# Altium project EtherWiz.PrjPcb
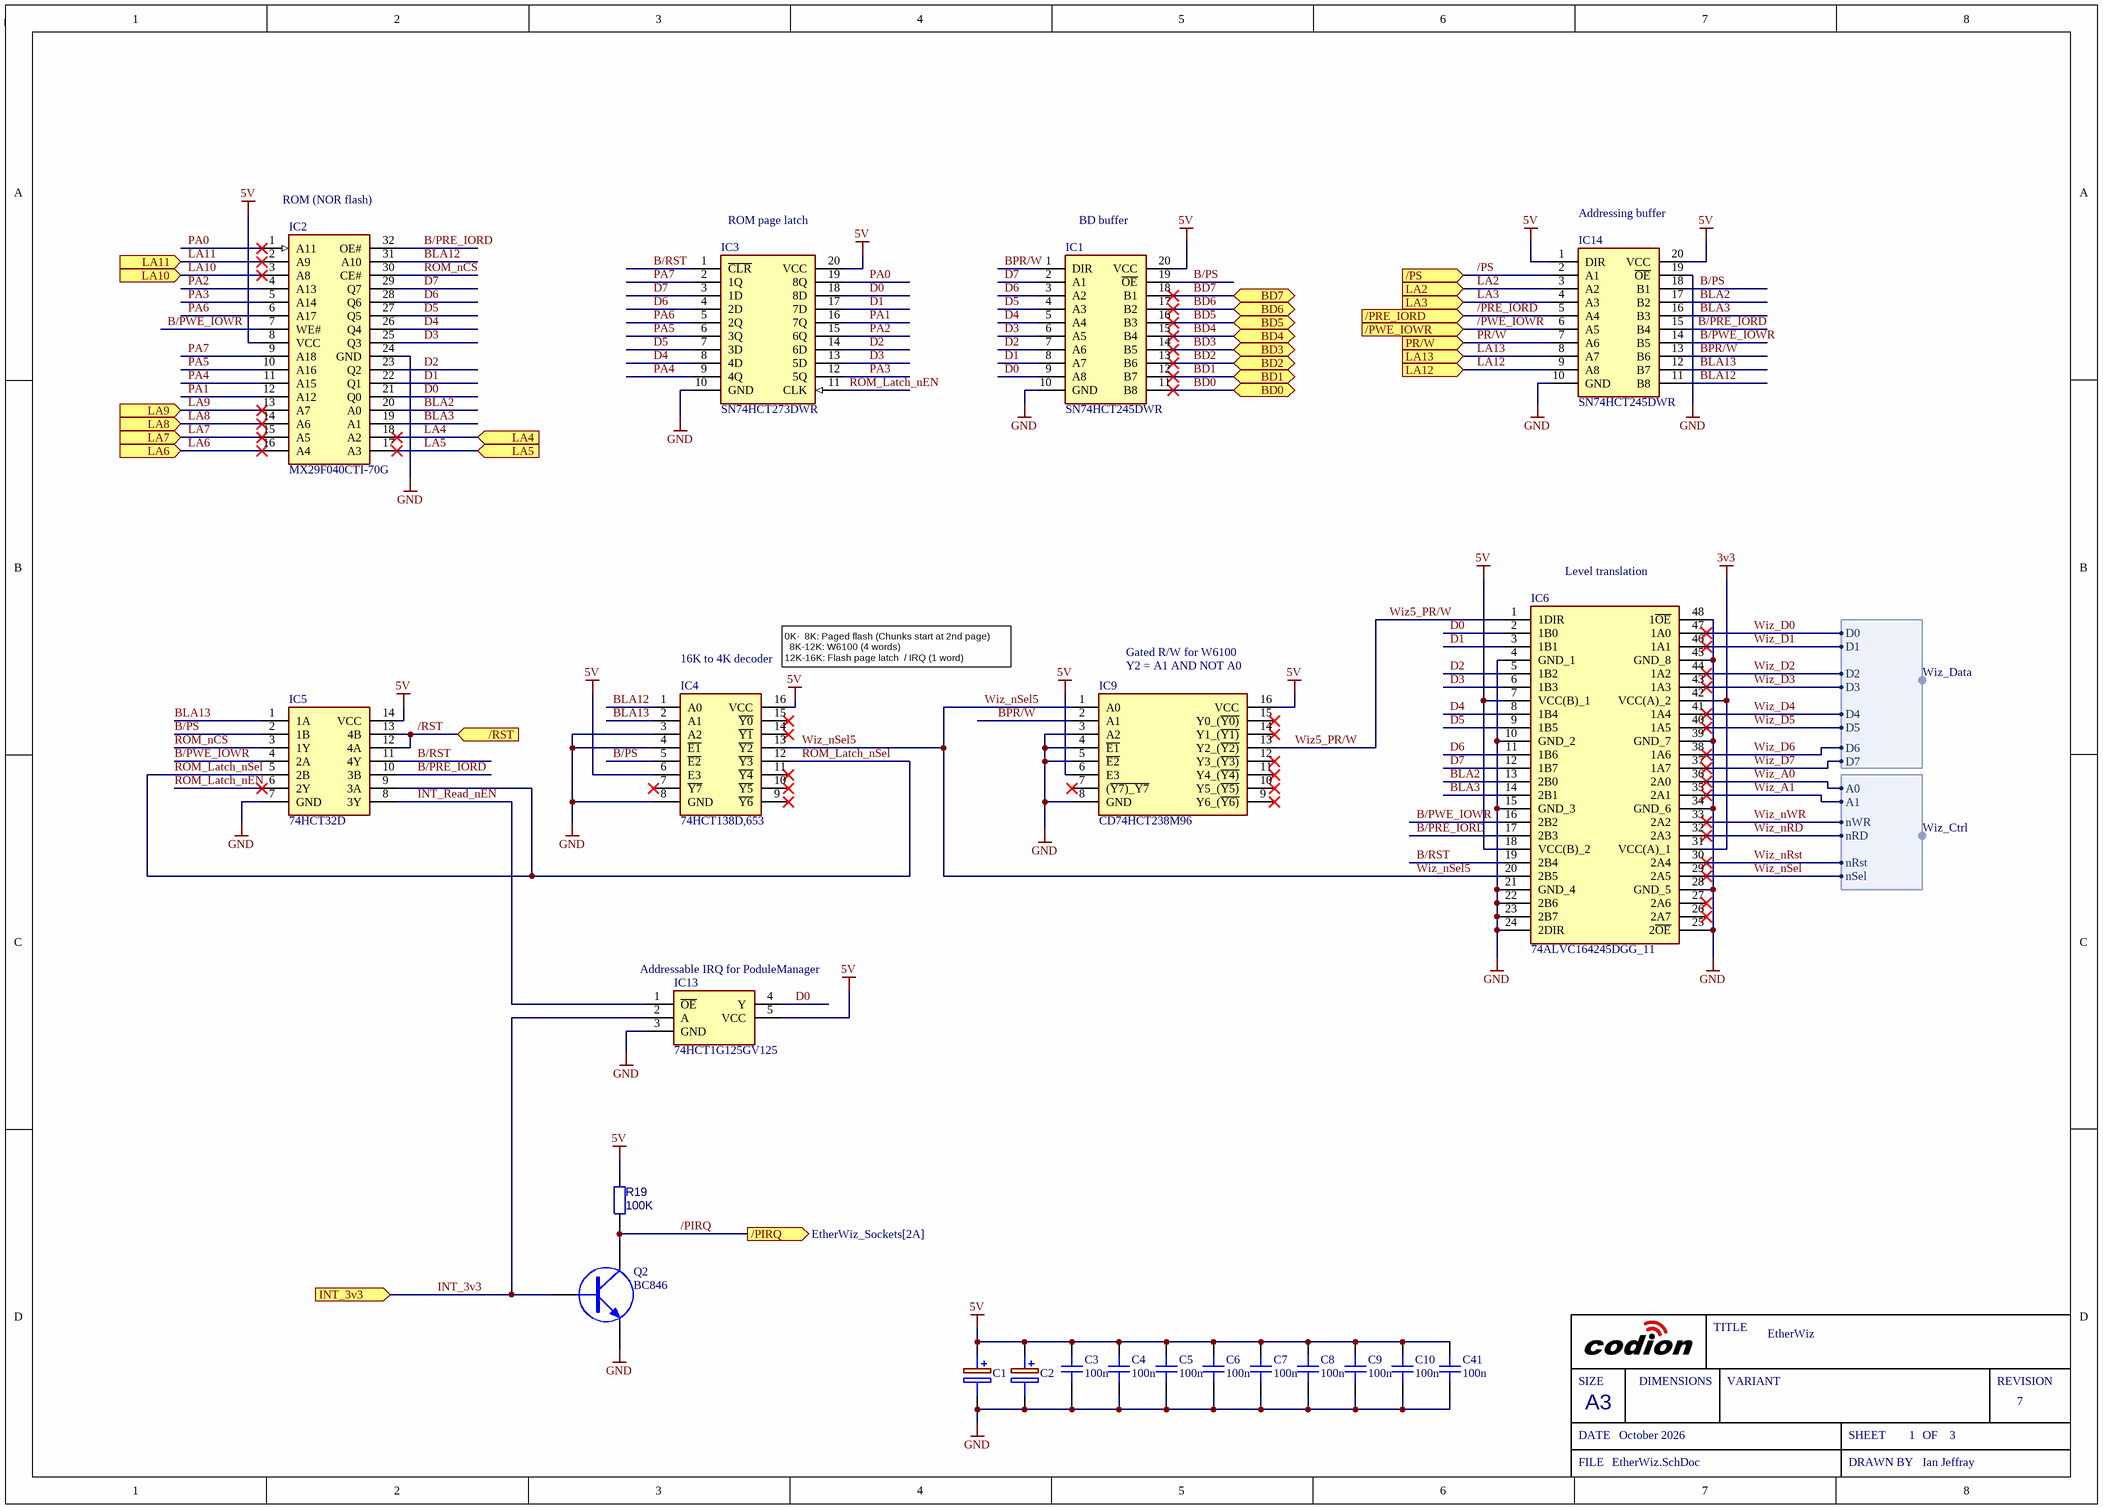
[diagram p0: EtherWiz.SchDoc]
Sch_RevNo: 7; Sch_ReleaseDate: October 2026; Project_Title: EtherWiz; PCB_RevNo: 1.1; DrawnBy: Ian Jeffray
3 sheets, 83 parts. Net scope: global (net labels, ports and power ports of the same name join across sheets).
Board files: EtherWiz.PcbDoc, EtherWizMini.PcbDoc, EtherWizA4.PcbDoc, EtherWiz3K4KNic.PcbDoc, EtherWizRiscPC7K.PcbDoc
Sheets:
  EtherWiz.SchDoc
  EtherWiz_Controller.SchDoc
  EtherWiz_Sockets.SchDoc

## Sheet EtherWiz.SchDoc
size A3; SheetNumber: 1; SheetTotal: 3

### Parts
C1  EEE-HA1C470AP  [EEE1AA101SP]  (value not drawn)
C2  EEE-HA1C470AP  [EEE1AA101SP]  (value not drawn)
C3  100n  [CAPC1608L]
C4  100n  [CAPC1608L]
C5  100n  [CAPC1608L]
C6  100n  [CAPC1608L]
C7  100n  [CAPC1608L]
C8  100n  [CAPC1608L]
C9  100n  [CAPC1608L]
C10  100n  [CAPC1608L]
C41  100n  [CAPC1608L]
IC1  SN74HCT245DWR  [SOIC127P1030X265-20N]
IC2  MX29F040CTI-70G  [SOP50P2000X120-32N]
IC3  SN74HCT273DWR  [SOIC127P1030X265-20N]
IC4  74HCT138D,653  [SOIC127P600X175-16N]
IC5  74HCT32D  [SOIC127P600X175-14N]
IC6  74ALVC164245DGG_11  [SOP50P810X120-48N]
IC9  CD74HCT238M96  [SOIC127P600X175-16N]
IC13  74HCT1G125GV125  [SOT95P275X110-5N]
IC14  SN74HCT245DWR  [SOIC127P1030X265-20N]
Q2  BC846  [SOT-23]
R19  100K  [RESC1608X50N]

### Ports
/PIRQ (out, see EtherWiz_Sockets[2A]), /PRE_IORD (in, see EtherWiz_Sockets[2A]), /PS (in, see EtherWiz_Sockets[2B]), /PWE_IOWR (in, see EtherWiz_Sockets[2A]), /RST (in, see EtherWiz_Sockets[2A]), BD0 (bidir, see EtherWiz_Sockets[1B]), BD1 (bidir, see EtherWiz_Sockets[1B]), BD2 (bidir, see EtherWiz_Sockets[1B]), BD3 (bidir, see EtherWiz_Sockets[1B]), BD4 (bidir, see EtherWiz_Sockets[1B]), BD5 (bidir, see EtherWiz_Sockets[1B]), BD6 (bidir, see EtherWiz_Sockets[1B]), BD7 (bidir, see EtherWiz_Sockets[1B]), INT_3v3 (in, see EtherWiz_Controller[5A]), LA2 (in, see EtherWiz_Sockets[1A]), LA3 (in, see EtherWiz_Sockets[1A]), LA4 (in, see EtherWiz_Sockets[1A]), LA5 (in, see EtherWiz_Sockets[1A]), LA6 (in, see EtherWiz_Sockets[1A]), LA7 (in, see EtherWiz_Sockets[1A]), LA8 (in, see EtherWiz_Sockets[1A]), LA9 (in, see EtherWiz_Sockets[1A]), LA10 (in, see EtherWiz_Sockets[1A]), LA11 (in, see EtherWiz_Sockets[1A]), LA12 (in, see EtherWiz_Sockets[1A]), LA13 (in, see EtherWiz_Sockets[1A]), PR/W (in, see EtherWiz_Sockets[2A])

### Harnesses
Wiz_Data: D3, D7, D6, D0, D1, D5, D4, D2
Wiz_Ctrl: A0, A1, nWR, nRD, nRst, nSel

### Nets
3v3: IC6.31(VCC(A)_1) IC6.42(VCC(A)_2)
5V: C1.1(+) C2.1(+) C3.2 C4.2 C5.2 C6.2 C7.2 C8.2 C9.2 C10.2 C41.2 IC1.20(VCC) IC2.8(VCC) IC3.20(VCC) IC4.6(E3) IC4.16(VCC) IC5.14(VCC) IC6.7(VCC(B)_1) IC6.18(VCC(B)_2) IC9.6(E3) IC9.16(VCC) IC13.5(VCC) IC14.1(DIR) IC14.20(VCC) R19.2
GND: C1.2(-) C2.2(-) C3.1 C4.1 C5.1 C6.1 C7.1 C8.1 C9.1 C10.1 C41.1 IC1.10(GND) IC2.24(GND) IC3.10(GND) IC4.3(A2) IC4.4(~{E1}) IC4.8(GND) IC5.7(GND) IC6.4(GND_1) IC6.10(GND_2) IC6.15(GND_3) IC6.21(GND_4) IC6.22(2B6) IC6.23(2B7) IC6.24(2DIR) IC6.25(2~{OE}) IC6.28(GND_5) IC6.34(GND_6) IC6.39(GND_7) IC6.45(GND_8) IC6.48(1~{OE}) IC9.3(A2) IC9.4(~{E1}) IC9.5(~{E2}) IC9.8(GND) IC13.3(GND) IC14.10(GND) IC14.19(~{OE}) Q2.2(E)
/PIRQ: Q2.3(C) R19.1 ; port /PIRQ
/PRE_IORD: IC14.5(A4) ; port /PRE_IORD
/PS: IC14.2(A1) ; port /PS
/PWE_IOWR: IC14.6(A5) ; port /PWE_IOWR
/RST: IC5.12(4A) IC5.13(4B) ; port /RST
B/PRE_IORD: IC2.32(OE#) IC5.10(3B) IC6.17(2B3) IC14.15(B4)
B/PS: IC1.19(~{OE}) IC4.5(~{E2}) IC5.2(1B) IC14.18(B1)
B/PWE_IOWR: IC2.7(WE#) IC5.4(2A) IC6.16(2B2) IC14.14(B5)
B/RST: IC3.1(~{CLR}) IC5.11(4Y) IC6.19(2B4)
BD0: IC1.11(B8) ; port BD0
BD1: IC1.12(B7) ; port BD1
BD2: IC1.13(B6) ; port BD2
BD3: IC1.14(B5) ; port BD3
BD4: IC1.15(B4) ; port BD4
BD5: IC1.16(B3) ; port BD5
BD6: IC1.17(B2) ; port BD6
BD7: IC1.18(B1) ; port BD7
BLA2: IC2.20(A0) IC6.13(2B0) IC14.17(B2)
BLA3: IC2.19(A1) IC6.14(2B1) IC14.16(B3)
BLA12: IC2.31(A10) IC4.1(A0) IC14.11(B8)
BLA13: IC4.2(A1) IC5.1(1A) IC14.12(B7)
BPR/W: IC1.1(DIR) IC9.2(A1) IC14.13(B6)
D0: IC1.9(A8) IC2.21(Q0) IC3.18(8D) IC6.2(1B0) IC13.4(Y)
D1: IC1.8(A7) IC2.22(Q1) IC3.17(7D) IC6.3(1B1)
D2: IC1.7(A6) IC2.23(Q2) IC3.14(6D) IC6.5(1B2)
D3: IC1.6(A5) IC2.25(Q3) IC3.13(5D) IC6.6(1B3)
D4: IC1.5(A4) IC2.26(Q4) IC3.8(4D) IC6.8(1B4)
D5: IC1.4(A3) IC2.27(Q5) IC3.7(3D) IC6.9(1B5)
D6: IC1.3(A2) IC2.28(Q6) IC3.4(2D) IC6.11(1B6)
D7: IC1.2(A1) IC2.29(Q7) IC3.3(1D) IC6.12(1B7)
INT_3v3: IC13.2(A) Q2.1(B) ; port INT_3v3
INT_Read_nEN: IC5.8(3Y) IC13.1(~{OE})
LA2: IC14.3(A2) ; port LA2
LA3: IC14.4(A3) ; port LA3
LA4: IC2.18(A2) ; port LA4
LA5: IC2.17(A3) ; port LA5
LA6: IC2.16(A4) ; port LA6
LA7: IC2.15(A5) ; port LA7
LA8: IC2.14(A6) ; port LA8
LA9: IC2.13(A7) ; port LA9
LA10: IC2.3(A8) ; port LA10
LA11: IC2.2(A9) ; port LA11
LA12: IC14.9(A8) ; port LA12
LA13: IC14.8(A7) ; port LA13
PA0: IC2.1(A11) IC3.19(8Q)
PA1: IC2.12(A12) IC3.16(7Q)
PA2: IC2.4(A13) IC3.15(6Q)
PA3: IC2.5(A14) IC3.12(5Q)
PA4: IC2.11(A15) IC3.9(4Q)
PA5: IC2.10(A16) IC3.6(3Q)
PA6: IC2.6(A17) IC3.5(2Q)
PA7: IC2.9(A18) IC3.2(1Q)
PR/W: IC14.7(A6) ; port PR/W
ROM_Latch_nEN: IC3.11(CLK) IC5.6(2Y)
ROM_Latch_nSel: IC4.12(~{Y3}) IC5.5(2B) IC5.9(3A)
ROM_nCS: IC2.30(CE#) IC5.3(1Y)
Wiz5_PR/W: IC6.1(1DIR) IC9.13(Y2_(~{Y2)})
Wiz_A0: IC6.36(2A0) ; harness Wiz_Ctrl.A0
Wiz_A1: IC6.35(2A1) ; harness Wiz_Ctrl.A1
Wiz_D0: IC6.47(1A0) ; harness Wiz_Data.D0
Wiz_D1: IC6.46(1A1) ; harness Wiz_Data.D1
Wiz_D2: IC6.44(1A2) ; harness Wiz_Data.D2
Wiz_D3: IC6.43(1A3) ; harness Wiz_Data.D3
Wiz_D4: IC6.41(1A4) ; harness Wiz_Data.D4
Wiz_D5: IC6.40(1A5) ; harness Wiz_Data.D5
Wiz_D6: IC6.38(1A6) ; harness Wiz_Data.D6
Wiz_D7: IC6.37(1A7) ; harness Wiz_Data.D7
Wiz_nRD: IC6.32(2A3) ; harness Wiz_Ctrl.nRD
Wiz_nRst: IC6.30(2A4) ; harness Wiz_Ctrl.nRst
Wiz_nSel: IC6.29(2A5) ; harness Wiz_Ctrl.nSel
Wiz_nSel5: IC4.13(~{Y2}) IC6.20(2B5) IC9.1(A0)
Wiz_nWR: IC6.33(2A2) ; harness Wiz_Ctrl.nWR

Not connected (* = marked no-connect by the designer): IC4 7(~{Y7})* 9(~{Y6})* 10(~{Y5})* 11(~{Y4})* 14(~{Y1})* 15(~{Y0})*; IC6 26(2A7)* 27(2A6)*; IC9 7((~{Y7)_Y7})* 9(Y6_(~{Y6)})* 10(Y5_(~{Y5)})* 11(Y4_(~{Y4)})* 12(Y3_(~{Y3)})* 14(Y1_(~{Y1)})* 15(Y0_(~{Y0)})*

### Notes on the sheet
- (near IC2) ROM (NOR flash)
- (near IC3) ROM page latch
- (near IC1) BD buffer
- (near IC14) Addressing buffer
- (near IC6) Level translation
- (near IC4) 16K to 4K decoder
- (near IC4) 0K-  8K: Paged flash (Chunks start at 2nd page)
  8K-12K: W6100 (4 words)
  12K-16K: Flash page latch  / IRQ (1 word)
- (near IC9) Gated R/W for W6100
- (near IC9) Y2 = A1 AND NOT A0
- (near IC13) Addressable IRQ for PoduleManager
- SIZE
- DIMENSIONS
- TITLE
- VARIANT
- REVISION
- DATE
- A3
- SHEET
- OF
- FILE
- DRAWN BY

### Library data of the parts
C1 C2 = EEE-HA1C470AP: Capacitor Polarised; Manufacturer_Name: Panasonic; Datasheet Link: http://industrial.panasonic.com/cdbs/www-data/pdf/RDE0000/ABA0000C1148.pdf; Height: 7.8mm; Manufacturer_Part_Number: EEE-HA1C470AP; Mouser Part Number: 667-EEE-HA1C470AP; Mouser Price/Stock: https://www.mouser.co.uk/ProductDetail/Panasonic/EEE-HA1C470AP?qs=d1CqaRUMZD%2FL5qU1hDRerg%3D%3D; Arrow Part Number: EEE-HA1C470AP; Arrow Price/Stock: https://www.arrow.com/en/products/eeeha1c470ap/panasonic?utm_currency=USD&region=europe
C3-C10 C41 = CAP_100n_0603_50V_0: CAP 100nF, 0603, 50V, X7R, 10%; Manufacturer1: Samsung; ManuPart1: CL10B104KB8NNNC; ManuPart2: CC0603KRX7R9BB104; Value: 100n; Distributor1: Anglia; Manufacturer2: Yageo; Distributor2: Digikey; Distributor1 Part No: CL10B104KB8NNNC; Distributor2 Part No: 311-1344-2-ND; ComponentLinknURL: *; ComponentLink1Description: ComponentLinknURL1; ComponentLink1URL: https://media.digikey.com/pdf/Data%20Sheets/Samsung%20PDFs/CL_Series_MLCC_ds.pdf; ComponentLink2Description: ComponentLinknURL2; ComponentLink2URL: https://www.yageo.com/upload/media/product/productsearch/datasheet/mlcc/UPY-GPHC_X7R_6.3V-to-50V_18.pdf; Voltage: 50V
IC1 IC14 = SN74HCT245DWR: Integrated Circuit; Manufacturer_Name: Texas Instruments; Datasheet Link: https://datasheet.datasheetarchive.com/originals/distributors/SFDatasheet-6/sf-000131457.pdf; Height: 2.65mm; Manufacturer_Part_Number: SN74HCT245DWR; Mouser Part Number: 595-SN74HCT245DWR; Mouser Price/Stock: https://www.mouser.co.uk/ProductDetail/Texas-Instruments/SN74HCT245DWR?qs=st7IWvlL5%2FhHLMwvvkYTgw%3D%3D; Arrow Part Number: SN74HCT245DWR; Arrow Price/Stock: https://www.arrow.com/en/products/sn74hct245dwr/texas-instruments?region=nac
IC2 = MX29F040CTI-70G: Integrated Circuit; Manufacturer_Name: Macronix; Datasheet Link: https://www.macronix.com/Lists/Datasheet/Attachments/7266/MX29F040C,%205V,%204Mb,%20v2.2.pdf; Height: 1.2mm; Manufacturer_Part_Number: MX29F040CTI-70G; Arrow Part Number: MX29F040CTI-70G; Arrow Price/Stock: https://www.arrow.com/en/products/mx29f040cti-70g/macronix-international?region=nac
IC3 = SN74HCT273DWR: Integrated Circuit; Manufacturer_Name: Texas Instruments; Datasheet Link: https://datasheet.datasheetarchive.com/originals/distributors/Datasheets-36/DSA-718641.pdf; Height: 2.65mm; Manufacturer_Part_Number: SN74HCT273DWR; Mouser Part Number: 595-SN74HCT273DWR; Mouser Price/Stock: https://www.mouser.co.uk/ProductDetail/Texas-Instruments/SN74HCT273DWR?qs=SL3LIuy2dWww%2FZr6up0MdA%3D%3D; Arrow Part Number: SN74HCT273DWR; Arrow Price/Stock: https://www.arrow.com/en/products/sn74hct273dwr/texas-instruments
IC4 = 74HCT138D,653: Integrated Circuit; Manufacturer_Name: Nexperia; Datasheet Link: https://assets.nexperia.com/documents/data-sheet/74HC_HCT138.pdf; Height: 1.75mm; Manufacturer_Part_Number: 74HCT138D,653; Mouser Part Number: 771-74HCT138D-T; Mouser Price/Stock: https://www.mouser.co.uk/ProductDetail/Nexperia/74HCT138D653?qs=P62ublwmbi8MKahyK7iY6g%3D%3D; Arrow Part Number: 74HCT138D,653; Arrow Price/Stock: https://www.arrow.com/en/products/74hct138d653/nexperia?region=nac
IC5 = 74HCT32D: Integrated Circuit; Manufacturer_Name: Toshiba; Datasheet Link: https://toshiba.semicon-storage.com/info/docget.jsp?did=37176&prodName=74HCT32D; Height: 1.75mm; Manufacturer_Part_Number: 74HCT32D; Mouser Part Number: N/A; Mouser Price/Stock: https://www.mouser.co.uk/ProductDetail/Toshiba/74HCT32D?qs=j%252B1pi9TdxUZqVZos7uP1Yw%3D%3D; Arrow Part Number: 74HCT32D; Arrow Price/Stock: https://www.arrow.com/en/products/74hct32d/toshiba?region=nac
IC6 = 74ALVC164245DGG_11: Integrated Circuit; Manufacturer_Name: Nexperia; Manufacturer_Part_Number: 74ALVC164245DGG:11; Datasheet Link: https://assets.nexperia.com/documents/data-sheet/74ALVC164245.pdf; Height: 1.2mm; Mouser Part Number: 771-74ALVC164245; Mouser Price/Stock: https://www.mouser.co.uk/ProductDetail/Nexperia/74ALVC164245DGG11?qs=odJ8N4Y39o4j0ykFPcnqaQ%3D%3D; Arrow Part Number: 74ALVC164245DGG:11; Arrow Price/Stock: https://www.arrow.com/en/products/74alvc164245dgg11/nexperia?utm_currency=USD&region=nac
IC9 = CD74HCT238M96: Integrated Circuit; Manufacturer_Name: Texas Instruments; Datasheet Link: http://www.ti.com/lit/gpn/cd74hct238; Height: 1.75mm; Manufacturer_Part_Number: CD74HCT238M96; Mouser Part Number: 595-CD74HCT238M96; Mouser Price/Stock: https://www.mouser.co.uk/ProductDetail/Texas-Instruments/CD74HCT238M96?qs=xFfolx0DHx1u%2Fks4%2FbIqqQ%3D%3D
IC13 = 74HCT1G125GV125: Integrated Circuit; Manufacturer_Name: Nexperia; Datasheet Link: https://assets.nexperia.com/documents/data-sheet/74HC_HCT1G125.pdf; Height: 1.1mm; Manufacturer_Part_Number: 74HCT1G125GV125
Q2 = TRANS_NPN_BC846_0: Transistor NPN, 65V, 100mA, TO-236AB/SOT23; Value: BC846; ComponentLinknURL: *
R19 = 920-0030-L: Resistor 100K 1%  0603; Value: 100K

## Sheet EtherWiz_Controller.SchDoc
size A3; SheetNumber: 2; SheetTotal: 3
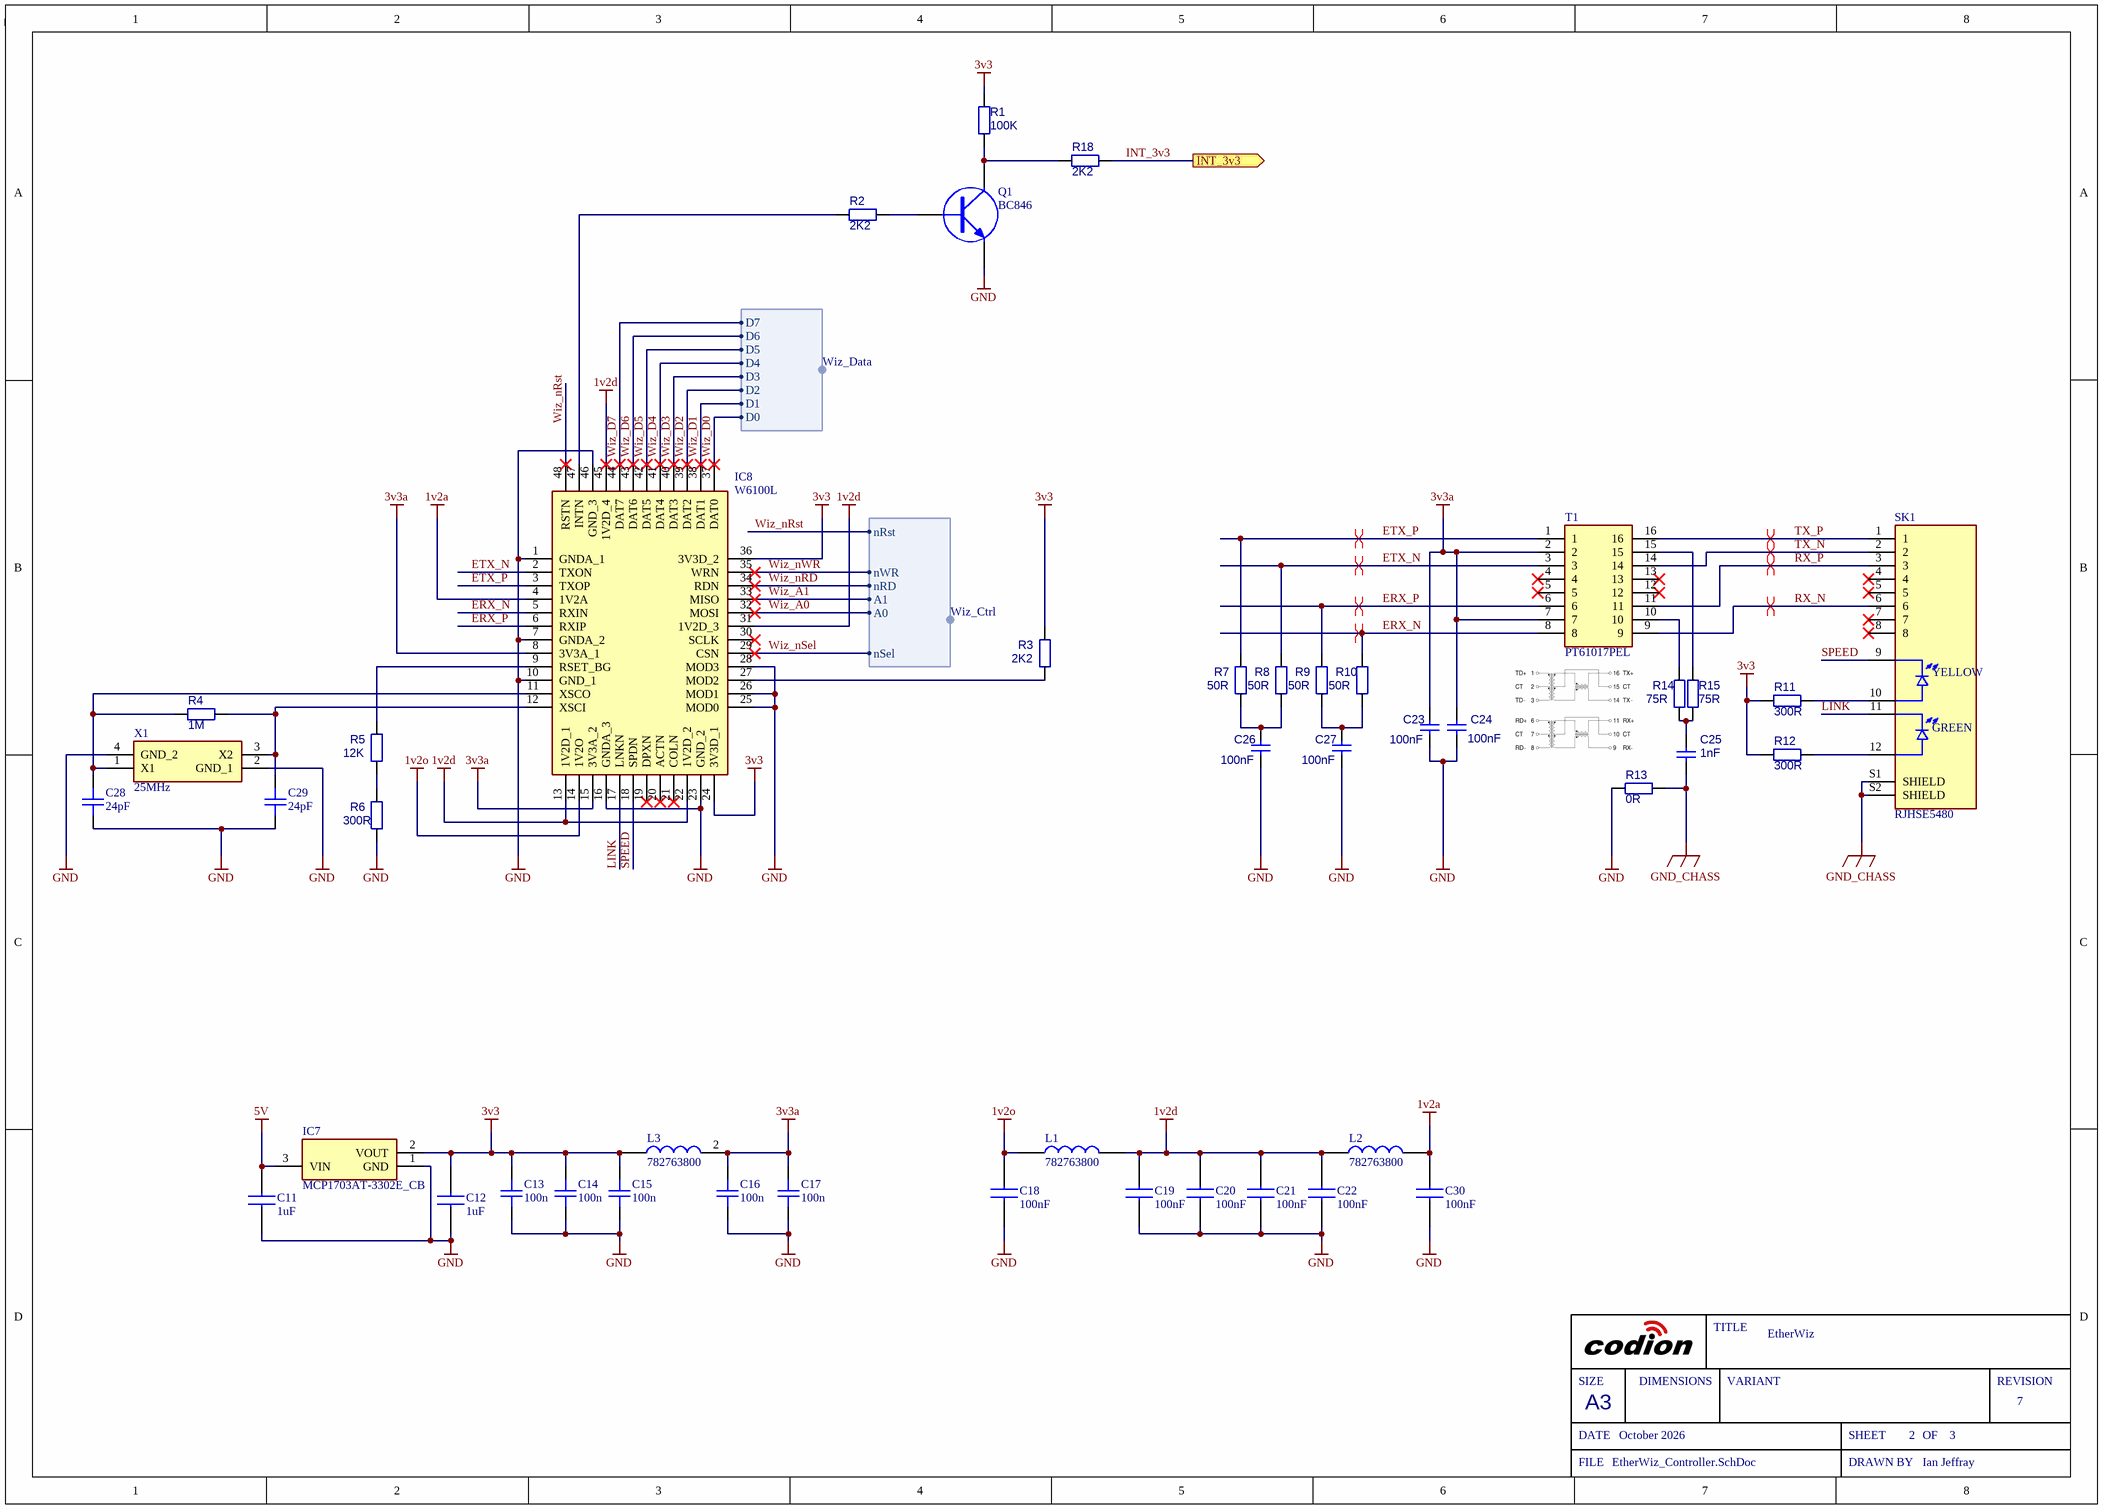
[diagram p1: EtherWiz_Controller.SchDoc]

### Parts
C11  1uF  [CAPC1608X90N]
C12  1uF  [CAPC1608X90N]
C13  100n  [CAPC1608L]
C14  100n  [CAPC1608L]
C15  100n  [CAPC1608L]
C16  100n  [CAPC1608L]
C17  100n  [CAPC1608L]
C18  100nF  [CAPC1608L]
C19  100nF  [CAPC1608L]
C20  100nF  [CAPC1608L]
C21  100nF  [CAPC1608L]
C22  100nF  [CAPC1608L]
C23  100nF  [CAPC1608L]
C24  100nF  [CAPC1608L]
C25  1nF  [CAPC1608L]
C26  100nF  [CAPC1608L]
C27  100nF  [CAPC1608L]
C28  24pF  [CAPC1608L]
C29  24pF  [CAPC1608L]
C30  100nF  [CAPC1608L]
IC7  MCP1703AT-3302E_CB  [SOT95P255X145-3N]
IC8  W6100L  [QFP50P900X900X160-48N]
L1  782763800  [INDC3216X130N]
L2  782763800  [INDC3216X130N]
L3  782763800  [INDC3216X130N]
Q1  BC846  [SOT-23]
R1  100K  [RESC1608X50N]
R2  2K2  [RESC1608X50N]
R3  2K2  [RESC1608X50N]
R4  1M  [RESC1608X50N]
R5  12K  [RESC1608X50N]
R6  300R  [RESC1608X50N]
R7  50R  [RESC1608X50N]
R8  50R  [RESC1608X50N]
R9  50R  [RESC1608X50N]
R10  50R  [RESC1608X50N]
R11  300R  [RESC1608X50N]
R12  300R  [RESC1608X50N]
R13  0R  [RESC1608L]
R14  75R  [RESC1608L]
R15  75R  [RESC1608L]
R18  2K2  [RESC1608X50N]
SK1  RJHSE5480  [AMPHENOL_RJHSE5480]
T1  PT61017PEL  [PT61017PEL]
X1  25MHz  [ABM810000MHZ12D2W]

### Ports
INT_3v3 (out, see EtherWiz[2D])

### Harnesses
Wiz_Data: D1, D0, D2, D3, D4, D5, D6, D7
Wiz_Ctrl: nWR, nSel, A1, A0, nRD, nRst

### Nets
1v2a: C30.2 IC8.4(1V2A) L2.2
1v2d: C19.2 C20.2 C21.2 C22.2 IC8.13(1V2D_1) IC8.22(1V2D_2) IC8.31(1V2D_3) IC8.45(1V2D_4) L1.2 L2.1
1v2o: C18.2 IC8.14(1V2O) L1.1
3v3: C12.2 C13.2 C14.2 C15.2 IC7.2(VOUT) IC8.24(3V3D_1) IC8.36(3V3D_2) L3.1 R1.2 R3.2 R11.2 R12.2
3v3a: C16.2 C17.2 C23.2 C24.2 IC8.8(3V3A_1) IC8.15(3V3A_2) L3.2 T1.2 T1.7
5V: C11.2 IC7.3(VIN)
GND: C11.1 C12.1 C13.1 C14.1 C15.1 C16.1 C17.1 C18.1 C19.1 C20.1 C21.1 C22.1 C23.1 C24.1 C26.1 C27.1 C28.1 C29.1 C30.1 IC7.1(GND) IC8.1(GNDA_1) IC8.7(GNDA_2) IC8.10(GND_1) IC8.16(GNDA_3) IC8.23(GND_2) IC8.25(MOD0) IC8.26(MOD1) IC8.28(MOD3) IC8.46(GND_3) Q1.2(E) R6.1 R13.1 X1.2(GND_1) X1.4(GND_2)
GND_CHASS: C25.1 R13.2 SK1.S1(SHIELD) SK1.S2(SHIELD)
ERX_N: IC8.5(RXIN) R10.2 T1.8
ERX_P: IC8.6(RXIP) R9.2 T1.6
ETX_N: IC8.2(TXON) R8.2 T1.3
ETX_P: IC8.3(TXOP) R7.2 T1.1
INT_3v3: R18.2 ; port INT_3v3
LINK: IC8.17(LNKN) SK1.11
RX_N: SK1.6 T1.9
RX_P: SK1.3 T1.11
SPEED: IC8.18(SPDN) SK1.9
TX_N: SK1.2 T1.14
TX_P: SK1.1 T1.16
Wiz_A0: IC8.32(MOSI) ; harness Wiz_Ctrl.A0
Wiz_A1: IC8.33(MISO) ; harness Wiz_Ctrl.A1
Wiz_D0: IC8.37(DAT0) ; harness Wiz_Data.D0
Wiz_D1: IC8.38(DAT1) ; harness Wiz_Data.D1
Wiz_D2: IC8.39(DAT2) ; harness Wiz_Data.D2
Wiz_D3: IC8.40(DAT3) ; harness Wiz_Data.D3
Wiz_D4: IC8.41(DAT4) ; harness Wiz_Data.D4
Wiz_D5: IC8.42(DAT5) ; harness Wiz_Data.D5
Wiz_D6: IC8.43(DAT6) ; harness Wiz_Data.D6
Wiz_D7: IC8.44(DAT7) ; harness Wiz_Data.D7
Wiz_nRD: IC8.34(RDN) ; harness Wiz_Ctrl.nRD
Wiz_nRst: IC8.48(RSTN) ; harness Wiz_Ctrl.nRst
Wiz_nSel: IC8.29(CSN) ; harness Wiz_Ctrl.nSel
Wiz_nWR: IC8.35(WRN) ; harness Wiz_Ctrl.nWR
NetC25_2: C25.2 R14.1 R15.1
NetC26_2: C26.2 R7.1 R8.1
NetC27_2: C27.2 R9.1 R10.1
NetC28_2: C28.2 IC8.11(XSCO) R4.2 X1.1(X1)
NetC29_2: C29.2 IC8.12(XSCI) R4.1 X1.3(X2)
NetIC8_9: IC8.9(RSET_BG) R5.2
NetIC8_27: IC8.27(MOD2) R3.1
NetIC8_47: IC8.47(INTN) R2.1
NetQ1_1: Q1.1(B) R2.2
NetQ1_3: Q1.3(C) R1.1 R18.1
NetR5_1: R5.1 R6.2
NetR11_1: R11.1 SK1.10
NetR12_1: R12.1 SK1.12
NetR14_2: R14.2 T1.10
NetR15_2: R15.2 T1.15

Not connected (* = marked no-connect by the designer): IC8 19(DPXN)* 20(ACTN)* 21(COLN)* 30(SCLK)*; SK1 4* 5* 7* 8*; T1 4* 5* 12* 13*

### Layout directives
differential pair: ERX_N, ERX_P, ETX_N, ETX_P, RX_N, RX_P, TX_N, TX_P

### Notes on the sheet
- SIZE
- DIMENSIONS
- TITLE
- VARIANT
- REVISION
- DATE
- A3
- SHEET
- OF
- FILE
- DRAWN BY
- (in symbol RJHSE5480) YELLOW; GREEN

### Library data of the parts
C11 C12 = CL10A105KP8NNNC: Capacitor; Manufacturer_Name: SAMSUNG; Datasheet Link: https://datasheet.lcsc.com/szlcsc/Samsung-Electro-Mechanics-CL10A105KP8NNNC_C26413.pdf; Height: 0.9mm; Manufacturer_Part_Number: CL10A105KP8NNNC; Mouser Part Number: 187-CL10A105KP8NNNC; Mouser Price/Stock: https://www.mouser.co.uk/ProductDetail/Samsung-Electro-Mechanics/CL10A105KP8NNNC?qs=349EhDEZ59qtu6tL%2F73n2A%3D%3D; Arrow Part Number: CL10A105KP8NNNC; Arrow Price/Stock: https://www.arrow.com/en/products/cl10a105kp8nnnc/samsung-electro-mechanics?utm_currency=USD&region=nac
C13-C17 = CAP_100n_0603_50V_0: as C3 on sheet EtherWiz; Value: 100n; Distributor1: Anglia; Manufacturer2: Yageo; Distributor2: Digikey; Distributor1 Part No: CL10B104KB8NNNC; Distributor2 Part No: 311-1344-2-ND; ComponentLinknURL: *; ComponentLink1Description: ComponentLinknURL1; ComponentLink1URL: https://media.digikey.com/pdf/Data%20Sheets/Samsung%20PDFs/CL_Series_MLCC_ds.pdf; ComponentLink2Description: ComponentLinknURL2; ComponentLink2URL: https://www.yageo.com/upload/media/product/productsearch/datasheet/mlcc/UPY-GPHC_X7R_6.3V-to-50V_18.pdf; Voltage: 50V
C18-C22 C30 = 100nF0805: Capacitor; Manufacturer_Name: TDK; Manufacturer_Part_Number: C2012X7R1H104K125AM; Datasheet Link: https://product.tdk.com/info/en/catalog/datasheets/mlcc_commercial_midvoltage_en.pdf; Height: 1.45mm; Mouser Part Number: 810-C2012X7R1H104KT5; Mouser Price/Stock: https://www.mouser.com/Search/Refine.aspx?Keyword=810-C2012X7R1H104KT5; Arrow Part Number: C2012X7R1H104K125AM; Arrow Price/Stock: https://www.arrow.com/en/products/c2012x7r1h104k125am/tdk; LCSC Part #: C111492
C23 C24 C26 C27 = 909-0001-L: Cap ceramic X7R/X5R 100nF 10% 16V C0603; Manufacturer: EPCOS; ManuPart: B37931-K9104-K60; Qualified2ndPart: CC0603KRX7R7BB104; Disti Part Number: 432-210; Tolerance: 0.1; Qualified2ndManu: Yageo; Cost(£): 0.038; Value: 100nF; Construction: X7R; Voltage: 16V; Simulation: CAP; Distributer: Farnell; RoHS Compliant: YES; Component Type: Standard; LCSC Part #: C66501
C25 = 910-0053-L: Cap ceramic X7R 1nF 10% 2kV C1206; Manufacturer: AVX; ManuPart: 1206GC102KAT1A; Tolerance: 0.1; Voltage: 2000V; Cost(£): 0.187; Value: 1nF; Construction: X7R; Simulation: CAP; Distributer: Anglia; Disti Part Number: 1206GC102KAT1A; RoHS Compliant: YES; Component Type: Standard; LCSC Part #: C23631
C28 C29 = CAP_10P_0603_50V_0: CAP 10PF, 0603, 50V, NP0, 10%; Value: 24pF; ComponentLinknURL: *
IC7 = MCP1703AT-3302E_CB: Integrated Circuit; Manufacturer_Name: Microchip; Manufacturer_Part_Number: MCP1703AT-3302E/CB; Datasheet Link: http://uk.rs-online.com/web/p/products/7709509; Height: 1.45mm; Mouser Part Number: 579-MCP1703AT3302ECB; Mouser Price/Stock: https://www.mouser.co.uk/ProductDetail/Microchip-Technology/MCP1703AT-3302E-CB?qs=PZkJWYMe7leeY97bgTp%252B9w%3D%3D; Arrow Part Number: MCP1703AT-3302E/CB; Arrow Price/Stock: https://www.arrow.com/en/products/mcp1703at-3302ecb/microchip-technology?region=nac
IC8 = W6100L: Integrated Circuit; Manufacturer_Name: WIZnet Inc; Datasheet Link: https://eu.mouser.com/datasheet/2/443/w6100_ds_v104e-1994614.pdf; Height: 1.6mm; Manufacturer_Part_Number: W6100L; Mouser Part Number: 950-W6100L; Mouser Price/Stock: https://www.mouser.co.uk/ProductDetail/WIZnet/W6100L?qs=pUKx8fyJudARLmbJE2EKlA%3D%3D
L1-L3 = 74279215: Inductor; Manufacturer_Name: Wurth Elektronik; Datasheet Link: http://componentsearchengine.com/Datasheets/1/74279215.pdf; Height: 1.3mm; Manufacturer_Part_Number: 782763800; Mouser Part Number: 710-782763800; Mouser Price/Stock: https://www.mouser.co.uk/ProductDetail/Wurth-Elektronik/74279215?qs=5twSNpOB8IC%252BebnV0jQtuw%3D%3D
Q1 = TRANS_NPN_BC846_0: as Q2 on sheet EtherWiz; Value: BC846; ComponentLinknURL: *
R1 = 920-0030-L: Resistor 100K 1%  0603; Value: 100K
R2 R3 R18 = 920-0030-L: Resistor 2K2 1%  0603; Manufacturer: Multicomp; ManuPart: MCWR06X75R0FTL; Disti Part Number: 2447434; Tolerance: 0.01; Power: 63mW; Cost(£): 0.025; Value: 2K2; Construction: Thick Film; Simulation: RES; Distributer: Farnell; RoHS Compliant: YES; Component Type: Standard; LCSC Part #: C127449
R4 = 920-0030-L: Resistor 1M 1%  0603; Manufacturer: Multicomp; ManuPart: MCWR06X75R0FTL; Disti Part Number: 2447434; Tolerance: 0.01; Power: 63mW; Cost(£): 0.025; Value: 1M; Construction: Thick Film; Simulation: RES; Distributer: Farnell; RoHS Compliant: YES; Component Type: Standard; LCSC Part #: C127449
R5 = 920-0030-L: Resistor 12K 1%  0603; Manufacturer: Multicomp; ManuPart: MCWR06X75R0FTL; Disti Part Number: 2447434; Tolerance: 0.01; Power: 63mW; Cost(£): 0.025; Value: 12K; Construction: Thick Film; Simulation: RES; Distributer: Farnell; RoHS Compliant: YES; Component Type: Standard; LCSC Part #: C127449
R6 = 920-0030-L: Resistor 300R 1%  0603; Manufacturer: Multicomp; ManuPart: MCWR06X75R0FTL; Disti Part Number: 2447434; Tolerance: 0.01; Power: 63mW; Cost(£): 0.025; Value: 300R; Construction: Thick Film; Simulation: RES; Distributer: Farnell; RoHS Compliant: YES; Component Type: Standard; LCSC Part #: C127449
R7-R10 = 920-0030-L: Resistor 50R 1%  0603; Manufacturer: Multicomp; ManuPart: MCWR06X75R0FTL; Disti Part Number: 2447434; Tolerance: 0.01; Power: 63mW; Cost(£): 0.025; Value: 50R; Construction: Thick Film; Simulation: RES; Distributer: Farnell; RoHS Compliant: YES; Component Type: Standard; LCSC Part #: C127449
R11 R12 = 920-0030-L: Resistor 300R 1%  0603; Value: 300R
R13 = 920-0001-L: Resistor 0R0 1A Max 0603; Manufacturer: Vishay; ManuPart: CRCW06030000Z0EA; Qualified2ndPart: RC0603JR-070RL; Disti Part Number: 923-3130; Qualified2ndManu: Yageo; Cost(£): 0.056; Value: 0R; Construction: Thick Film; Simulation: RES; Distributer: Farnell; RoHS Compliant: YES; Component Type: Standard; LCSC Part #: C844718
R14 R15 = 920-0030-L: Resistor 75R 1%  0603; Manufacturer: Multicomp; ManuPart: MCWR06X75R0FTL; Disti Part Number: 2447434; Tolerance: 0.01; Power: 63mW; Cost(£): 0.025; Value: 75R; Construction: Thick Film; Simulation: RES; Distributer: Farnell; RoHS Compliant: YES; Component Type: Standard; LCSC Part #: C127449
SK1 = RJHSE5480: Ethernet socket - through hole; Manufacturer: Amphenol; Disti Part Number: 2709018; ManuPart: RJHSE-5480; Value: *; Distributer: Farnell
T1 = PT61017PEL: Transformer; Manufacturer: Bourns; Disti Part Number: 652-PT61017PEL; Datasheet Link: http://www.bourns.com/docs/Product-Datasheets/pt61017pel.pdf; Height: 5mm; ManuPart: PT61017PEL; Mouser Price/Stock: https://www.mouser.co.uk/ProductDetail/Bourns/PT61017PEL?qs=0rbOLB9uh%252BASY8PB9lbWrQ%3D%3D; Distributer: Mouser; Arrow Price/Stock: https://www.arrow.com/en/products/pt61017pel/bourns?region=europe; LCSC Part #: C124001
X1 = ABM8-25.000MHZ-D2X-T: Crystal or Oscillator; Manufacturer_Name: ABRACON; Datasheet Link: https://abracon.com/Resonators/abm8.pdf; Height: 0.8mm; Manufacturer_Part_Number: ABM8-25.000MHZ-D2X-T; Mouser Part Number: 815-ABM825MHZD2XT; Mouser Price/Stock: https://www.mouser.co.uk/ProductDetail/ABRACON/ABM8-25.000MHZ-D2X-T?qs=XeJtXLiO41RuPiM7CXbPRQ%3D%3D; Arrow Part Number: ABM8-25.000MHZ-D2X-T; Arrow Price/Stock: https://www.arrow.com/en/products/abm8-25.000mhz-d2x-t/abracon?region=nac

## Sheet EtherWiz_Sockets.SchDoc
size A3; SheetNumber: 3; SheetTotal: 3
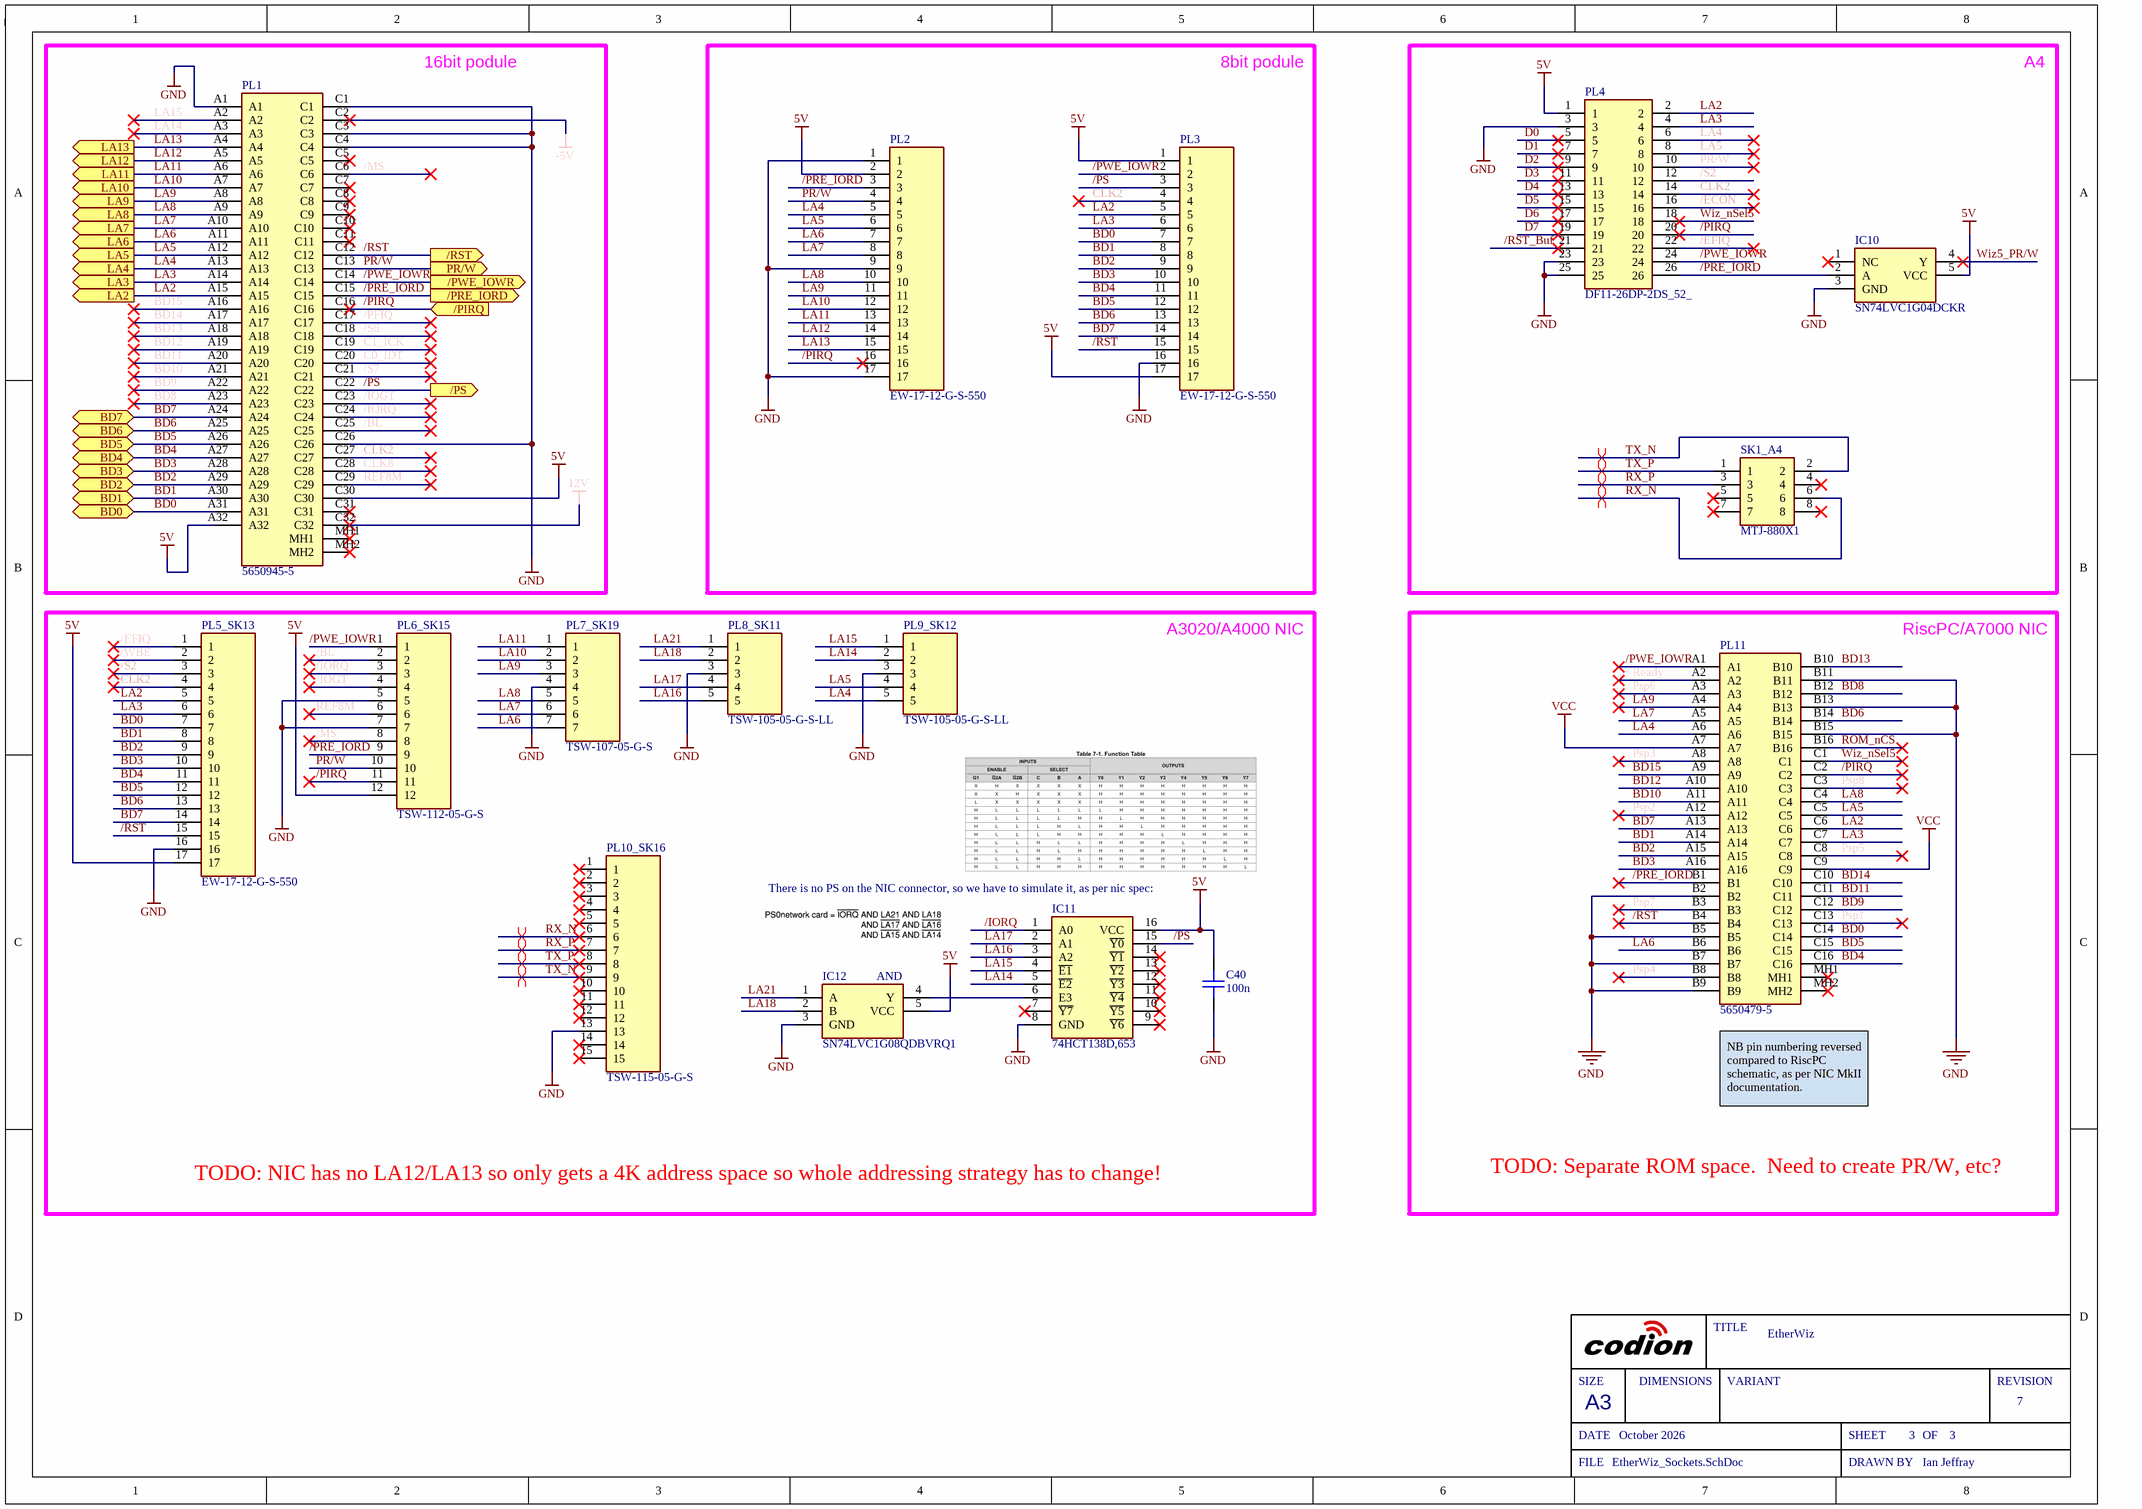
[diagram p2: EtherWiz_Sockets.SchDoc]

### Parts
C40  100n  [CAPC1608L]
IC10  SN74LVC1G04DCKR  [SOT65P210X110-5N]
IC11  74HCT138D,653  [SOIC127P600X175-16N]
IC12  SN74LVC1G08QDBVRQ1  [SOT95P280X145-5N]
PL1  5650945-5  [56509455]
PL2  EW-17-12-G-S-550  [TSW-117-XX-YY-S]
PL3  EW-17-12-G-S-550  [TSW-117-XX-YY-S]
PL4  DF11-26DP-2DS_52_  [SHDRRA26W50P200_2X13_2800X1000X500P]
PL5_SK13  EW-17-12-G-S-550  [TSW-117-XX-YY-S]
PL6_SK15  TSW-112-05-G-S  [TSW-112-XX-YY-S]
PL7_SK19  TSW-107-05-G-S  [TSW-107-XX-YY-S]
PL8_SK11  TSW-105-05-G-S-LL  [HDRV5W64P0X254_1X5_1270X254X521P]
PL9_SK12  TSW-105-05-G-S-LL  [HDRV5W64P0X254_1X5_1270X254X521P]
PL10_SK16  TSW-115-05-G-S  [TSW-115-XX-YY-S]
PL11  5650479-5  [56504795]
SK1_A4  MTJ-880X1  [MTJ880X1]

### Blocks framed on the sheet
16bit podule: PL1
8bit podule: PL2 PL3
A4: IC10 PL4 SK1_A4
A3020/A4000 NIC: C40 IC11 IC12 PL5_SK13 PL6_SK15 PL7_SK19 PL8_SK11 PL9_SK12 PL10_SK16
TODO: Separate ROM space.  Need to create PR/W, etc?: PL11

### Ports
/PIRQ (in, see EtherWiz[3D]), /PRE_IORD (out, see EtherWiz[6A]), /PS (out, see EtherWiz[6A]), /PWE_IOWR (out, see EtherWiz[6A]), /RST (out, see EtherWiz[2B]), BD0 (bidir, see EtherWiz[5B]), BD1 (bidir, see EtherWiz[5A]), BD2 (bidir, see EtherWiz[5A]), BD3 (bidir, see EtherWiz[5A]), BD4 (bidir, see EtherWiz[5A]), BD5 (bidir, see EtherWiz[5A]), BD6 (bidir, see EtherWiz[5A]), BD7 (bidir, see EtherWiz[5A]), LA2 (out, see EtherWiz[6A]), LA3 (out, see EtherWiz[6A]), LA4 (out, see EtherWiz[2B]), LA5 (out, see EtherWiz[2B]), LA6 (out, see EtherWiz[1B]), LA7 (out, see EtherWiz[1B]), LA8 (out, see EtherWiz[1B]), LA9 (out, see EtherWiz[1B]), LA10 (out, see EtherWiz[1A]), LA11 (out, see EtherWiz[1A]), LA12 (out, see EtherWiz[6A]), LA13 (out, see EtherWiz[6A]), PR/W (out, see EtherWiz[6A])

### Nets
5V: C40.2 IC10.5(VCC) IC11.16(VCC) IC12.5(VCC) PL1.A32 PL1.C30 PL2.2 PL3.1 PL3.17 PL4.1 PL5_SK13.17 PL6_SK15.12
12V: PL1.C32
-5V: PL1.C2
GND: C40.1 IC10.3(GND) IC11.8(GND) IC12.3(GND) PL1.A1 PL1.C1 PL1.C3 PL1.C4 PL1.C26 PL2.1 PL2.9 PL2.17 PL3.16 PL4.3 PL4.23 PL4.25 PL5_SK13.16 PL6_SK15.5 PL6_SK15.7 PL7_SK19.4 PL8_SK11.3 PL9_SK12.3 PL10_SK16.13 PL11.B2 PL11.B5 PL11.B7 PL11.B9 PL11.B11 PL11.B13 PL11.B15
VCC: PL11.A7 PL11.C9
/BL: PL1.C25 PL6_SK15.2
/ECON: PL4.16
/EFIQ: PL4.22 PL5_SK13.1
/IOGT: PL1.C23 PL6_SK15.4
/IORQ: IC11.1(A0) PL1.C24 PL6_SK15.3
/MS: PL1.C6 PL6_SK15.8
/PFIQ: PL1.C17
/PIRQ: PL1.C16 PL2.16 PL4.20 PL6_SK15.11 PL11.C2 ; port /PIRQ
/PRE_IORD: IC10.2(A) PL1.C15 PL2.3 PL4.26 PL6_SK15.9 PL11.B1 ; port /PRE_IORD
/PS: IC11.15(~{Y0}) PL1.C22 PL3.3 ; port /PS
/PWE_IOWR: PL1.C14 PL3.2 PL4.24 PL6_SK15.1 PL11.A1 ; port /PWE_IOWR
/RST: PL1.C12 PL3.15 PL5_SK13.15 PL11.B4 ; port /RST
/RST_Buf: PL4.21
/S2: PL4.12 PL5_SK13.3
/S6: PL1.C18
/S7: PL1.C21
/WBE: PL5_SK13.2
BD0: PL1.A31 PL3.7 PL5_SK13.7 PL11.C14 ; port BD0
BD1: PL1.A30 PL3.8 PL5_SK13.8 PL11.A14 ; port BD1
BD2: PL1.A29 PL3.9 PL5_SK13.9 PL11.A15 ; port BD2
BD3: PL1.A28 PL3.10 PL5_SK13.10 PL11.A16 ; port BD3
BD4: PL1.A27 PL3.11 PL5_SK13.11 PL11.C16 ; port BD4
BD5: PL1.A26 PL3.12 PL5_SK13.12 PL11.C15 ; port BD5
BD6: PL1.A25 PL3.13 PL5_SK13.13 PL11.B14 ; port BD6
BD7: PL1.A24 PL3.14 PL5_SK13.14 PL11.A13 ; port BD7
BD8: PL1.A23 PL11.B12
BD9: PL1.A22 PL11.C12
BD10: PL1.A21 PL11.A11
BD11: PL1.A20 PL11.C11
BD12: PL1.A19 PL11.A10
BD13: PL1.A18 PL11.B10
BD14: PL1.A17 PL11.C10
BD15: PL1.A16 PL11.A9
C0_IDT: PL1.C20
C1_ICK: PL1.C19
CLK2: PL1.C27 PL3.4 PL4.14 PL5_SK13.4
CLK8: PL1.C28
D0: PL4.5
D1: PL4.7
D2: PL4.9
D3: PL4.11
D4: PL4.13
D5: PL4.15
D6: PL4.17
D7: PL4.19
LA2: PL1.A15 PL3.5 PL4.2 PL5_SK13.5 PL11.C6 ; port LA2
LA3: PL1.A14 PL3.6 PL4.4 PL5_SK13.6 PL11.C7 ; port LA3
LA4: PL1.A13 PL2.5 PL4.6 PL9_SK12.5 PL11.A6 ; port LA4
LA5: PL1.A12 PL2.6 PL4.8 PL9_SK12.4 PL11.C5 ; port LA5
LA6: PL1.A11 PL2.7 PL7_SK19.7 PL11.B6 ; port LA6
LA7: PL1.A10 PL2.8 PL7_SK19.6 PL11.A5 ; port LA7
LA8: PL1.A9 PL2.10 PL7_SK19.5 PL11.C4 ; port LA8
LA9: PL1.A8 PL2.11 PL7_SK19.3 PL11.A4 ; port LA9
LA10: PL1.A7 PL2.12 PL7_SK19.2 ; port LA10
LA11: PL1.A6 PL2.13 PL7_SK19.1 ; port LA11
LA12: PL1.A5 PL2.14 ; port LA12
LA13: PL1.A4 PL2.15 ; port LA13
LA14: IC11.5(~{E2}) PL1.A3 PL9_SK12.2
LA15: IC11.4(~{E1}) PL1.A2 PL9_SK12.1
LA16: IC11.3(A2) PL8_SK11.5
LA17: IC11.2(A1) PL8_SK11.4
LA18: IC12.2(B) PL8_SK11.2
LA21: IC12.1(A) PL8_SK11.1
PR/W: PL1.C13 PL2.4 PL4.10 PL6_SK15.10 ; port PR/W
Psp1: PL11.C13
Psp2: PL11.A12
Psp3: PL11.A8
Psp4: PL11.B8
Psp5: PL11.C8
Psp6: PL11.A3
Psp7: PL11.B3
Psp8: PL11.C3
Ready: PL11.A2
REF8M: PL1.C29 PL6_SK15.6
ROM_nCS: PL11.B16
RX_N: PL10_SK16.6 SK1_A4.6
RX_P: PL10_SK16.7 SK1_A4.3
TX_N: PL10_SK16.9 SK1_A4.2
TX_P: PL10_SK16.8 SK1_A4.1
Wiz5_PR/W: IC10.4(Y)
Wiz_nSel5: PL4.18 PL11.C1
NetIC11_6: IC11.6(E3) IC12.4(Y)

Not connected (* = marked no-connect by the designer): IC10 1(NC)*; IC11 7(~{Y7})* 9(~{Y6})* 10(~{Y5})* 11(~{Y4})* 12(~{Y3})* 13(~{Y2})* 14(~{Y1})*; PL1 C5* C7* C8* C9* C10* C11* C31* MH1* MH2*; PL10_SK16 1* 2* 3* 4* 5* 10* 11* 12* 14* 15*; PL11 MH1* MH2*; SK1_A4 4* 5* 7* 8*

### Layout directives
differential pair: RX_N, RX_P, TX_N, TX_P

### Notes on the sheet
- RiscPC/A7000 NIC
- (near IC11) There is no PS on the NIC connector, so we have to simulate it, as per nic spec:
- (near IC12) AND
- (near PL11) NB pin numbering reversed compared to RiscPC schematic, as per NIC MkII documentation.
- TODO: NIC has no LA12/LA13 so only gets a 4K address space so whole addressing strategy has to change!
- SIZE
- DIMENSIONS
- TITLE
- VARIANT
- REVISION
- DATE
- A3
- SHEET
- OF
- FILE
- DRAWN BY

### Library data of the parts
C40 = CAP_100n_0603_50V_0: as C3 on sheet EtherWiz; Value: 100n; Distributor1: Anglia; Manufacturer2: Yageo; Distributor2: Digikey; Distributor1 Part No: CL10B104KB8NNNC; Distributor2 Part No: 311-1344-2-ND; ComponentLinknURL: *; ComponentLink1Description: ComponentLinknURL1; ComponentLink1URL: https://media.digikey.com/pdf/Data%20Sheets/Samsung%20PDFs/CL_Series_MLCC_ds.pdf; ComponentLink2Description: ComponentLinknURL2; ComponentLink2URL: https://www.yageo.com/upload/media/product/productsearch/datasheet/mlcc/UPY-GPHC_X7R_6.3V-to-50V_18.pdf; Voltage: 50V
IC10 = SN74LVC1G04DCKR: Integrated Circuit; Manufacturer_Name: Texas Instruments; Datasheet Link: http://www.ti.com/lit/ds/symlink/sn74lvc1g04.pdf; Height: 1.1mm; Manufacturer_Part_Number: SN74LVC1G04DCKR; Mouser Part Number: 595-SN74LVC1G04DCKR; Mouser Price/Stock: https://www.mouser.co.uk/ProductDetail/Texas-Instruments/SN74LVC1G04DCKR?qs=dT9u2OTAaVWNPsQmeXyvkg%3D%3D; Arrow Part Number: SN74LVC1G04DCKR; Arrow Price/Stock: https://www.arrow.com/en/products/sn74lvc1g04dckr/texas-instruments?region=nac
IC11 = 74HCT138D,653: as IC4 on sheet EtherWiz; Datasheet Link: https://assets.nexperia.com/documents/data-sheet/74HC_HCT138.pdf; Height: 1.75mm; Manufacturer_Part_Number: 74HCT138D,653; Mouser Part Number: 771-74HCT138D-T; Mouser Price/Stock: https://www.mouser.co.uk/ProductDetail/Nexperia/74HCT138D653?qs=P62ublwmbi8MKahyK7iY6g%3D%3D; Arrow Part Number: 74HCT138D,653; Arrow Price/Stock: https://www.arrow.com/en/products/74hct138d653/nexperia?region=nac
IC12 = SN74LVC1G08QDBVRQ1: Integrated Circuit; Manufacturer_Name: Texas Instruments; Datasheet Link: http://www.ti.com/lit/ds/symlink/sn74lvc1g08-q1.pdf; Height: 1.45mm; Manufacturer_Part_Number: SN74LVC1G08QDBVRQ1; Mouser Part Number: 595-SN74LVC1G08QDBQ1; Mouser Price/Stock: https://www.mouser.co.uk/ProductDetail/Texas-Instruments/SN74LVC1G08QDBVRQ1?qs=PVVDbbWpW3K%252BPBrUmLG6eg%3D%3D; Arrow Part Number: SN74LVC1G08QDBVRQ1; Arrow Price/Stock: https://www.arrow.com/en/products/sn74lvc1g08qdbvrq1/texas-instruments?utm_currency=USD&region=nac
PL1 = 5650945-5: Connector; Manufacturer_Name: TE Connectivity; Datasheet Link: https://www.te.com/commerce/DocumentDelivery/DDEController?Action=showdoc&DocId=Customer+Drawing%7F650473%7FS%7Fpdf%7FEnglish%7FENG_CD_650473_S_baseFilename.pdf%7F5650945-5; Height: 11.1mm; Manufacturer_Part_Number: 5650945-5; Mouser Part Number: 571-5650945-5; Mouser Price/Stock: https://www.mouser.co.uk/ProductDetail/TE-Connectivity/5650945-5?qs=%2FFe7VTH785B%252B77b5t925bQ%3D%3D; Arrow Part Number: 5650945-5; Arrow Price/Stock: https://www.arrow.com/en/products/5650945-5/te-connectivity
PL2 PL3 PL5_SK13 = TSW-117-05-G-S: Connector; Manufacturer_Name: SAMTEC; Datasheet Link: http://suddendocs.samtec.com/prints/tsw-xxx-xx-xxx-x-xx-xxx-mkt.pdf; Manufacturer_Part_Number: TSW-117-05-G-S
PL4 = DF11-26DP-2DS_52_: Connector; Manufacturer_Name: Hirose; Manufacturer_Part_Number: DF11-26DP-2DS(52); Datasheet Link: https://www.hirose.com/product/document?clcode=CL0543-0544-8-52&productname=DF11-26DP-2DS(52)&series=DF11&documenttype=2DDrawing&lang=en&documentid=0000995291; Height: 5mm; Mouser Part Number: 798-DF11-26DP-2DS52; Mouser Price/Stock: https://www.mouser.co.uk/ProductDetail/Hirose-Connector/DF11-26DP-2DS52?qs=Ux3WWAnHpjAoQVMFZWdmwg%3D%3D; Arrow Part Number: DF11-26DP-2DS(52); Arrow Price/Stock: https://www.arrow.com/en/products/df11-26dp-2ds-52/hirose-electric
PL6_SK15 = TSW-112-05-G-S: Connector; Manufacturer_Name: SAMTEC; Datasheet Link: http://suddendocs.samtec.com/prints/tsw-xxx-xx-xxx-x-xx-xxx-mkt.pdf; Manufacturer_Part_Number: TSW-112-05-G-S
PL7_SK19 = TSW-107-05-G-S: Connector; Manufacturer_Name: SAMTEC; Datasheet Link: http://suddendocs.samtec.com/prints/tsw-xxx-xx-xxx-x-xx-xxx-mkt.pdf; Manufacturer_Part_Number: TSW-107-05-G-S
PL8_SK11 PL9_SK12 = TSW-105-05-G-S-LL: Connector; Manufacturer_Name: SAMTEC; Datasheet Link: https://componentsearchengine.com/Datasheets/2/TSW-105-05-G-S-LL.pdf; Height: 5.21mm; Manufacturer_Part_Number: TSW-105-05-G-S-LL
PL10_SK16 = TSW-115-05-G-S: Connector; Manufacturer_Name: SAMTEC; Datasheet Link: http://suddendocs.samtec.com/prints/tsw-xxx-xx-xxx-x-xx-xxx-mkt.pdf; Manufacturer_Part_Number: TSW-115-05-G-S
PL11 = 5650479-5: Connector; Manufacturer_Name: TE Connectivity; Datasheet Link: https://www.te.com/commerce/DocumentDelivery/DDEController?Action=showdoc&DocId=Customer+Drawing%7F5650479%7FP%7Fpdf%7FEnglish%7FENG_CD_5650479_P.pdf%7F5650479-5; Height: 11.61mm; Manufacturer_Part_Number: 5650479-5; Mouser Part Number: 571-5650479-5; Mouser Price/Stock: https://www.mouser.co.uk/ProductDetail/TE-Connectivity/5650479-5?qs=xrnNvQC1SKQu%252BZBLSdOcFw%3D%3D; Arrow Part Number: 5650479-5; Arrow Price/Stock: https://www.arrow.com/en/products/5650479-5/te-connectivity?region=europe
SK1_A4 = MTJ-880X1: Connector; Manufacturer_Name: Adam Tech; Datasheet Link: https://app.adam-tech.com/products/download/data_sheet/203795/mtj-880x1-data-sheet.pdf; Height: 12.9794mm; Manufacturer_Part_Number: MTJ-880X1; Mouser Part Number: 737-MTJ-880X1; Mouser Price/Stock: https://www.mouser.co.uk/ProductDetail/Adam-Tech/MTJ-880X1?qs=TTVbHWoAP%2FTHQFSSStritA%3D%3D; Arrow Part Number: MTJ-880X1; Arrow Price/Stock: https://www.arrow.com/en/products/mtj-880x1/adam-tech?region=nac

## Nets that join several sheets
3v3: EtherWiz (IC6.31 IC6.42), EtherWiz_Controller (12 pins)
5V: EtherWiz (25 pins), EtherWiz_Controller (C11.2 IC7.3), EtherWiz_Sockets (12 pins)
GND: EtherWiz (39 pins), EtherWiz_Controller (34 pins), EtherWiz_Sockets (30 pins)
/PIRQ: EtherWiz (Q2.3 R19.1), EtherWiz_Sockets (5 pins)
/PRE_IORD: EtherWiz (IC14.5), EtherWiz_Sockets (6 pins)
/PS: EtherWiz (IC14.2), EtherWiz_Sockets (IC11.15 PL1.C22 PL3.3)
/PWE_IOWR: EtherWiz (IC14.6), EtherWiz_Sockets (5 pins)
/RST: EtherWiz (IC5.12 IC5.13), EtherWiz_Sockets (PL1.C12 PL3.15 PL5_SK13.15 PL11.B4)
BD0: EtherWiz (IC1.11), EtherWiz_Sockets (PL1.A31 PL3.7 PL5_SK13.7 PL11.C14)
BD1: EtherWiz (IC1.12), EtherWiz_Sockets (PL1.A30 PL3.8 PL5_SK13.8 PL11.A14)
BD2: EtherWiz (IC1.13), EtherWiz_Sockets (PL1.A29 PL3.9 PL5_SK13.9 PL11.A15)
BD3: EtherWiz (IC1.14), EtherWiz_Sockets (PL1.A28 PL3.10 PL5_SK13.10 PL11.A16)
BD4: EtherWiz (IC1.15), EtherWiz_Sockets (PL1.A27 PL3.11 PL5_SK13.11 PL11.C16)
BD5: EtherWiz (IC1.16), EtherWiz_Sockets (PL1.A26 PL3.12 PL5_SK13.12 PL11.C15)
BD6: EtherWiz (IC1.17), EtherWiz_Sockets (PL1.A25 PL3.13 PL5_SK13.13 PL11.B14)
BD7: EtherWiz (IC1.18), EtherWiz_Sockets (PL1.A24 PL3.14 PL5_SK13.14 PL11.A13)
D0: EtherWiz (5 pins), EtherWiz_Sockets (PL4.5)
D1: EtherWiz (IC1.8 IC2.22 IC3.17 IC6.3), EtherWiz_Sockets (PL4.7)
D2: EtherWiz (IC1.7 IC2.23 IC3.14 IC6.5), EtherWiz_Sockets (PL4.9)
D3: EtherWiz (IC1.6 IC2.25 IC3.13 IC6.6), EtherWiz_Sockets (PL4.11)
D4: EtherWiz (IC1.5 IC2.26 IC3.8 IC6.8), EtherWiz_Sockets (PL4.13)
D5: EtherWiz (IC1.4 IC2.27 IC3.7 IC6.9), EtherWiz_Sockets (PL4.15)
D6: EtherWiz (IC1.3 IC2.28 IC3.4 IC6.11), EtherWiz_Sockets (PL4.17)
D7: EtherWiz (IC1.2 IC2.29 IC3.3 IC6.12), EtherWiz_Sockets (PL4.19)
INT_3v3: EtherWiz (IC13.2 Q2.1), EtherWiz_Controller (R18.2)
LA2: EtherWiz (IC14.3), EtherWiz_Sockets (5 pins)
LA3: EtherWiz (IC14.4), EtherWiz_Sockets (5 pins)
LA4: EtherWiz (IC2.18), EtherWiz_Sockets (5 pins)
LA5: EtherWiz (IC2.17), EtherWiz_Sockets (5 pins)
LA6: EtherWiz (IC2.16), EtherWiz_Sockets (PL1.A11 PL2.7 PL7_SK19.7 PL11.B6)
LA7: EtherWiz (IC2.15), EtherWiz_Sockets (PL1.A10 PL2.8 PL7_SK19.6 PL11.A5)
LA8: EtherWiz (IC2.14), EtherWiz_Sockets (PL1.A9 PL2.10 PL7_SK19.5 PL11.C4)
LA9: EtherWiz (IC2.13), EtherWiz_Sockets (PL1.A8 PL2.11 PL7_SK19.3 PL11.A4)
LA10: EtherWiz (IC2.3), EtherWiz_Sockets (PL1.A7 PL2.12 PL7_SK19.2)
LA11: EtherWiz (IC2.2), EtherWiz_Sockets (PL1.A6 PL2.13 PL7_SK19.1)
LA12: EtherWiz (IC14.9), EtherWiz_Sockets (PL1.A5 PL2.14)
LA13: EtherWiz (IC14.8), EtherWiz_Sockets (PL1.A4 PL2.15)
PR/W: EtherWiz (IC14.7), EtherWiz_Sockets (PL1.C13 PL2.4 PL4.10 PL6_SK15.10)
ROM_nCS: EtherWiz (IC2.30 IC5.3), EtherWiz_Sockets (PL11.B16)
RX_N: EtherWiz_Controller (SK1.6 T1.9), EtherWiz_Sockets (PL10_SK16.6 SK1_A4.6)
RX_P: EtherWiz_Controller (SK1.3 T1.11), EtherWiz_Sockets (PL10_SK16.7 SK1_A4.3)
TX_N: EtherWiz_Controller (SK1.2 T1.14), EtherWiz_Sockets (PL10_SK16.9 SK1_A4.2)
TX_P: EtherWiz_Controller (SK1.1 T1.16), EtherWiz_Sockets (PL10_SK16.8 SK1_A4.1)
Wiz5_PR/W: EtherWiz (IC6.1 IC9.13), EtherWiz_Sockets (IC10.4)
Wiz_A0: EtherWiz (IC6.36), EtherWiz_Controller (IC8.32)
Wiz_A1: EtherWiz (IC6.35), EtherWiz_Controller (IC8.33)
Wiz_D0: EtherWiz (IC6.47), EtherWiz_Controller (IC8.37)
Wiz_D1: EtherWiz (IC6.46), EtherWiz_Controller (IC8.38)
Wiz_D2: EtherWiz (IC6.44), EtherWiz_Controller (IC8.39)
Wiz_D3: EtherWiz (IC6.43), EtherWiz_Controller (IC8.40)
Wiz_D4: EtherWiz (IC6.41), EtherWiz_Controller (IC8.41)
Wiz_D5: EtherWiz (IC6.40), EtherWiz_Controller (IC8.42)
Wiz_D6: EtherWiz (IC6.38), EtherWiz_Controller (IC8.43)
Wiz_D7: EtherWiz (IC6.37), EtherWiz_Controller (IC8.44)
Wiz_nRD: EtherWiz (IC6.32), EtherWiz_Controller (IC8.34)
Wiz_nRst: EtherWiz (IC6.30), EtherWiz_Controller (IC8.48)
Wiz_nSel: EtherWiz (IC6.29), EtherWiz_Controller (IC8.29)
Wiz_nSel5: EtherWiz (IC4.13 IC6.20 IC9.1), EtherWiz_Sockets (PL4.18 PL11.C1)
Wiz_nWR: EtherWiz (IC6.33), EtherWiz_Controller (IC8.35)

## Assembly variants
Full Podule: not fitted C40 IC10 IC11 IC12 PL2 PL3 PL4 PL5_SK13 PL6_SK15 PL7_SK19 PL8_SK11 PL9_SK12 PL10_SK16 PL? SK1_A4
Mini Podule: not fitted C40 IC10 IC11 IC12 PL1 PL4 PL5_SK13 PL6_SK15 PL7_SK19 PL8_SK11 PL9_SK12 PL10_SK16 PL? SK1_A4
A4: not fitted C1 C2 C3 C4 C5 C7 C8 C9 C40 C41 IC1 IC2 IC3 IC4 IC5 IC9 IC11 IC12 IC13 IC14 PL1 PL2 PL3 PL5_SK13 PL6_SK15 PL7_SK19 PL8_SK11 PL9_SK12 PL10_SK16 PL? R11 R12 SK1
A3020_A4000: not fitted IC10 PL1 PL2 PL3 PL4 PL? R11 R12 SK1 SK1_A4
RiscPC_A7000: not fitted C40 IC3 IC10 IC11 IC12 PL1 PL2 PL3 PL4 PL5_SK13 PL6_SK15 PL7_SK19 PL8_SK11 PL9_SK12 PL10_SK16 SK1_A4